# EAGLE design CacheMakerUno (EAGLE 6.5.0)
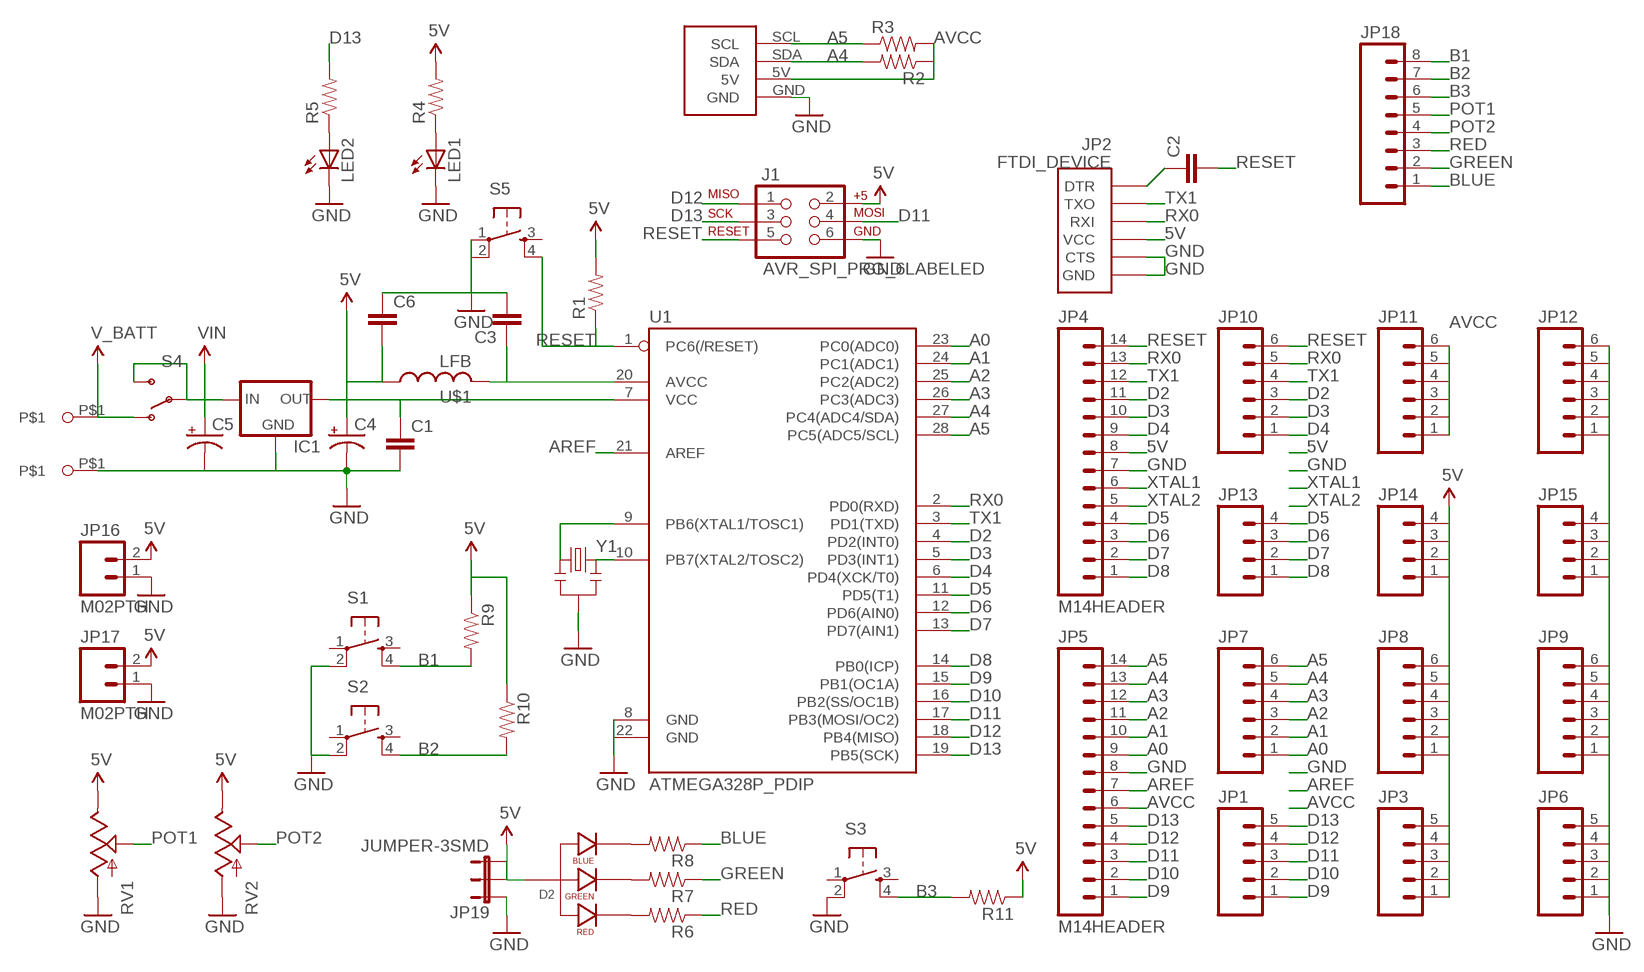
[diagram p0: schematic, sheet 1]

## Parts
C1  CAPPTH  [CAP-PTH-SMALL]
C2  CAPPTH  [CAP-PTH-SMALL]
C3  CAPPTH  [CAP-PTH-SMALL]
C4  CAP_POL2MM  [CAP-PTH-2MM]
C5  CAP_POL2MM  [CAP-PTH-2MM]
C6  CAPPTH  [CAP-PTH-SMALL]
D2  LED-RGB-CA-THRUDIFFUSE  [LED-RGB-THRU]
GND  M1  [M1_NO_STRAIN]
IC1  V_REG_78XXBASIC  [TO-220-REG-BASIC]
J1  AVR_SPI_PRG_6LABELED  [2X3-NS]
JP1  M05NO_SILK  [1X05_NO_SILK]
JP2  FTDI_DEVICE  [FTDI_DEVICE_SIDE]
JP3  M05NO_SILK  [1X05_NO_SILK]
JP4  M14HEADER  [1X14-HEADER]
JP5  M14HEADER  [1X14-HEADER]
JP6  M05NO_SILK  [1X05_NO_SILK]
JP7  M06SIP  [1X06]
JP8  M06SIP  [1X06]
JP9  M06SIP  [1X06]
JP10  M06SIP  [1X06]
JP11  M06SIP  [1X06]
JP12  M06SIP  [1X06]
JP13  M04PTH  [1X04]
JP14  M04PTH  [1X04]
JP15  M04PTH  [1X04]
JP16  M02PTH  [1X02]
JP17  M02PTH  [1X02]
JP18  M081X08  [1X08]
JP19  JUMPER-3SMD  [SJ_3]
LED1  LED5MM  [LED5MM]
LED2  LED5MM  [LED5MM]
R1  RESISTORAXIAL-0.3  [AXIAL-0.3]
R2  RESISTORAXIAL-0.3  [AXIAL-0.3]
R3  RESISTORAXIAL-0.3  [AXIAL-0.3]
R4  RESISTORPTH-1/4W-VERT  [AXIAL-0.1]
R5  RESISTORAXIAL-0.3  [AXIAL-0.3]
R6  RESISTORPTH-1/4W-VERT  [AXIAL-0.1]
R7  RESISTORPTH-1/4W-VERT  [AXIAL-0.1]
R8  RESISTORPTH-1/4W-VERT  [AXIAL-0.1]
R9  RESISTORPTH-1/4W-VERT  [AXIAL-0.1]
R10  RESISTORPTH-1/4W-VERT  [AXIAL-0.1]
R11  RESISTORPTH-1/4W-VERT  [AXIAL-0.1]
RV1  POTTRIM  [TRIM_POT]
RV2  POTTRIM  [TRIM_POT]
S1  TAC_SWITCHPTH  [TACTILE-PTH]
S2  TAC_SWITCHPTH  [TACTILE-PTH]
S3  TAC_SWITCHPTH  [TACTILE-PTH]
S4  SWITCH-SPDTPTH  [SWITCH-SPDT]
S5  TAC_SWITCHPTH  [TACTILE-PTH]
U1  ATMEGA328P_PDIP  [DIL28-3]
U$1  LFB  [ALFB-01]
U$2  I2C  [I2C]
V+  M1  [M1_NO_STRAIN]
Y1  RESONATORPTH  [RESONATOR-PTH]

## Nets
5V: C1.1 C4.+ C6.2 D2.2(ANODE) IC1.3(OUT) J1.2 JP2.P$4(VCC) JP3.1 JP3.2 JP3.3 JP3.4 JP3.5 JP4.8 JP8.1 JP8.2 JP8.3 JP8.4 JP8.5 JP8.6 JP14.1 JP14.2 JP14.3 JP14.4 JP16.2 JP17.2 JP19.2 JP19.3 R1.P$2 R4.P$2 R9.P$1 R10.P$1 R11.P$1 RV1.2(E) RV2.2(E) U1.7(VCC) U$1.1
A0: JP5.9 JP7.1 U1.23(PC0(ADC0))
A1: JP5.10 JP7.2 U1.24(PC1(ADC1))
A2: JP5.11 JP7.3 U1.25(PC2(ADC2))
A3: JP5.12 JP7.4 U1.26(PC3(ADC3))
A4: JP5.13 JP7.5 R2.P$2 U1.27(PC4(ADC4/SDA)) U$2.SDA
A5: JP5.14 JP7.6 R3.P$1 U1.28(PC5(ADC5/SCL)) U$2.SCL
AREF: JP5.7 U1.21(AREF)
AVCC: C3.1 JP5.6 JP11.1 JP11.2 JP11.3 JP11.4 JP11.5 JP11.6 R2.P$1 R3.P$2 U1.20(AVCC) U$1.2 U$2.5V
B1: JP18.8 R9.P$2 S1.4
B2: JP18.7 R10.P$2 S2.4
B3: JP18.6 R11.P$2 S3.4
BLUE: JP18.1 R8.P$1
D2: JP4.11 JP10.3 U1.4(PD2(INT0))
D3: JP4.10 JP10.2 U1.5(PD3(INT1))
D4: JP4.9 JP10.1 U1.6(PD4(XCK/T0))
D5: JP4.4 JP13.4 U1.11(PD5(T1))
D6: JP4.3 JP13.3 U1.12(PD6(AIN0))
D7: JP4.2 JP13.2 U1.13(PD7(AIN1))
D8: JP4.1 JP13.1 U1.14(PB0(ICP))
D9: JP1.1 JP5.1 U1.15(PB1(OC1A))
D10: JP1.2 JP5.2 U1.16(PB2(SS/OC1B))
D11: J1.4 JP1.3 JP5.3 U1.17(PB3(MOSI/OC2))
D12: J1.1 JP1.4 JP5.4 U1.18(PB4(MISO))
D13: J1.3 JP1.5 JP5.5 R5.P$2 U1.19(PB5(SCK))
DTR: C2.1 JP2.P$1(DTR)
GND: C1.2 C3.2 C4.- C5.- C6.1 GND.P$1 IC1.2(GND) J1.6 JP2.P$5(CTS) JP2.P$6(GND) JP4.7 JP5.8 JP6.1 JP6.2 JP6.3 JP6.4 JP6.5 JP9.1 JP9.2 JP9.3 JP9.4 JP9.5 JP9.6 JP12.1 JP12.2 JP12.3 JP12.4 JP12.5 JP12.6 JP15.1 JP15.2 JP15.3 JP15.4 JP16.1 JP17.1 JP19.1 LED1.K(C) LED2.K(C) RV1.3(A) RV2.3(A) S1.2 S2.2 S3.2 S5.1 S5.2 U1.8(GND) U1.22(GND) U$2.GND Y1.2
GREEN: JP18.2 R7.P$1
N$1: LED1.A R4.P$1
N$2: LED2.A R5.P$1
N$3: D2.1(RED_CATHODE) R6.P$2
N$4: D2.3(GREEN_CATHODE) R7.P$2
N$5: D2.4(BLUE_CATHODE) R8.P$2
POT1: JP18.5 RV1.1(S)
POT2: JP18.4 RV2.1(S)
RED: JP18.3 R6.P$1
RESET: C2.2 J1.5 JP4.14 JP10.6 R1.P$1 S5.4 U1.1(PC6(/RESET))
RX0: JP2.P$3(RXI) JP4.13 JP10.5 U1.2(PD0(RXD))
TX1: JP2.P$2(TXO) JP4.12 JP10.4 U1.3(PD1(TXD))
V_BATT: S4.1(O) V+.P$1
VIN: C5.+ IC1.1(IN) S4.2(P) S4.3(S)
XTAL1: JP4.6 U1.9(PB6(XTAL1/TOSC1)) Y1.1
XTAL2: JP4.5 U1.10(PB7(XTAL2/TOSC2)) Y1.3
Unconnected: S1.1 S1.3 S2.1 S2.3 S3.1 S3.3 S5.3

## Library data of the parts
C1-C3 C6 = barbary_enterprises:CAP: Capacitor Standard 0603 ceramic capacitor, and 0.1" leaded capacitor.
C4 C5 = barbary_enterprises:CAP_POL: Capacitor Polarized These are standard SMD and PTH capacitors. Normally 10uF, 47uF, and 100uF in electrolytic and tantalum varieties. Always verify the external diameter of the through hole cap, it varies with capacity, voltage, and manufacturer. The EIA devices should be standard.
D2 = barbary_enterprises:LED-RGB-CA-THRU: RGB Through-hole common anode SparkFun store front COM-10821 (diffuse) COM-10820 (clear); PROD_ID: DIO-10632
GND V+ = barbary_enterprises:M1
IC1 = SparkFun-PowerIC:V_REG_78XX: Voltage Regulator Standard 7805 5V regulator. IGO (Input Ground Output). Spark Fun Electronics SKU : COM-00107
J1 = barbary_enterprises:AVR_SPI_PRG_6: AVR ISP 6 Pin This is the reduced ISP connector for AVR programming. Common on Arduino. This footprint will take up less PCB space and can be used with a 10-pin to 6-pin adapter such as SKU: BOB-08508
JP1 JP3 JP6 = SparkFun-Connectors:M05: Header 5 Standard 5-pin 0.1" header. Use with straight break away headers (SKU : PRT-00116), right angle break away headers (PRT-00553), swiss pins (PRT-00743), machine pins (PRT-00117), and female headers (PRT-00115). Molex polarized connector foot print use with SKU : PRT-08230 with associated crimp pins and housings.
JP2 = SparkFun-Connectors:FTDI_DEVICE: Connector which mates to FTDI basic or FTDI cable.
JP4 JP5 = ProtoDuino:M14: Header 14 Standard 14-pin 0.1" header. Use with straight break away headers (SKU : PRT-00116), right angle break away headers (PRT-00553), swiss pins (PRT-00743), machine pins (PRT-00117), and female headers (PRT-00115).
JP7-JP12 = SparkFun-Connectors:M06: Header 6 Standard 6-pin 0.1" header. Use with straight break away headers (SKU : PRT-00116), right angle break away headers (PRT-00553), swiss pins (PRT-00743), machine pins (PRT-00117), and female headers (PRT-00115). Molex polarized connector foot print use with SKU : PRT-08094 with associated crimp pins and housings. NOTES ON THE VARIANTS LOCK and LOCK_LONGPADS... This footprint was designed to help hold the alignment of a through-hole component (i.e. 6-pin header) while soldering it into place. You may notice that each hole has been shifted either up or down by 0.005 of an inch from it's more standard position (which is a perfectly straight line). This slight alteration caused the pins (the squares in the middle) to touch the edges of the holes. Because they are alternating, it causes a "brace" to hold the component in place. 0.005 has proven to be the perfect amount of "off-center" position when using our standard breakaway headers. Although looks a little odd when you look at the bare footprint, once you have a header in there, the alteration is very hard to notice. Also,if you push a header all the way into place, it is covered up entirely on the bottom side. This idea of altering the position of holes to aid alignment will be further integrated into the Sparkfun Library for other footprints. It can help hold any component with 3 or more connection pins.
JP13-JP15 = SparkFun-Connectors:M04: Header 4 Standard 4-pin 0.1" header. Use with straight break away headers (SKU : PRT-00116), right angle break away headers (PRT-00553), swiss pins (PRT-00743), machine pins (PRT-00117), and female headers (PRT-00115). Molex polarized connector foot print use with SKU : PRT-08231 with associated crimp pins and housings. 1MM SMD Version SKU: PRT-10208
JP16 JP17 = SparkFun-Connectors:M02: Standard 2-pin 0.1" header. Use with - straight break away headers ( PRT-00116) - right angle break away headers (PRT-00553) - swiss pins (PRT-00743) - machine pins (PRT-00117) - female headers (PRT-00115) Molex polarized connector foot print use with: PRT-08233 with associated crimp pins and housings. 2.54_SCREWTERM for use with PRT-10571. 3.5mm Screw Terminal footprints for PRT-08084 5mm Screw Terminal footprints for use with PRT-08433
JP18 = SparkFun-Connectors:M08: Header 8 Standard 8-pin 0.1" header. Use with straight break away headers (SKU : PRT-00116), right angle break away headers (PRT-00553), swiss pins (PRT-00743), machine pins (PRT-00117), and female headers (PRT-00115).
JP19 = SparkFun-Passives:JUMPER-3
LED1 LED2 = SparkFun-LED:LED: LEDs Standard schematic elements and footprints for 5mm, 3mm, 1206, and 0603 sized LEDs. 5mm - Spark Fun Electronics SKU : COM-00529 (and others)
R1-R11 = SparkFun-Resistors:RESISTOR: Resistor Basic schematic elements and footprints for 0603, 1206, and PTH resistors.
RV1 RV2 = SparkFun-Electromechanical:POT
S1-S3 S5 = SparkFun-Electromechanical:TAC_SWITCH: Momentary Switch Button commonly used for reset or general input. Spark Fun Electronics SKU : COM-00097 SMT- SWCH-08247
S4 = SparkFun-Electromechanical:SWITCH-SPDT: SPDT Switch Simple slide switch, Spark Fun Electronics SKU : COM-00102 DPDT SMT slide switch, AYZ0202, SWCH-08179
U1 = SparkFun-DigitalIC:ATMEGA328P_PDIP: uC used in the Arduino 32kb flash, 1k EEPROM, 2k SRAM This is the through-hole version of this chip.
U$1 = barbary_enterprises:L
U$2 = barbary_enterprises:I2C
Y1 = SparkFun-FreqCtrl:RESONATOR: Resonator Small SMD resonator. Used, eg, on the Arduino Pro/ Pro Mini boards. 8MHz- XTAL-08895 16MHz- XTAL-08900

## Board
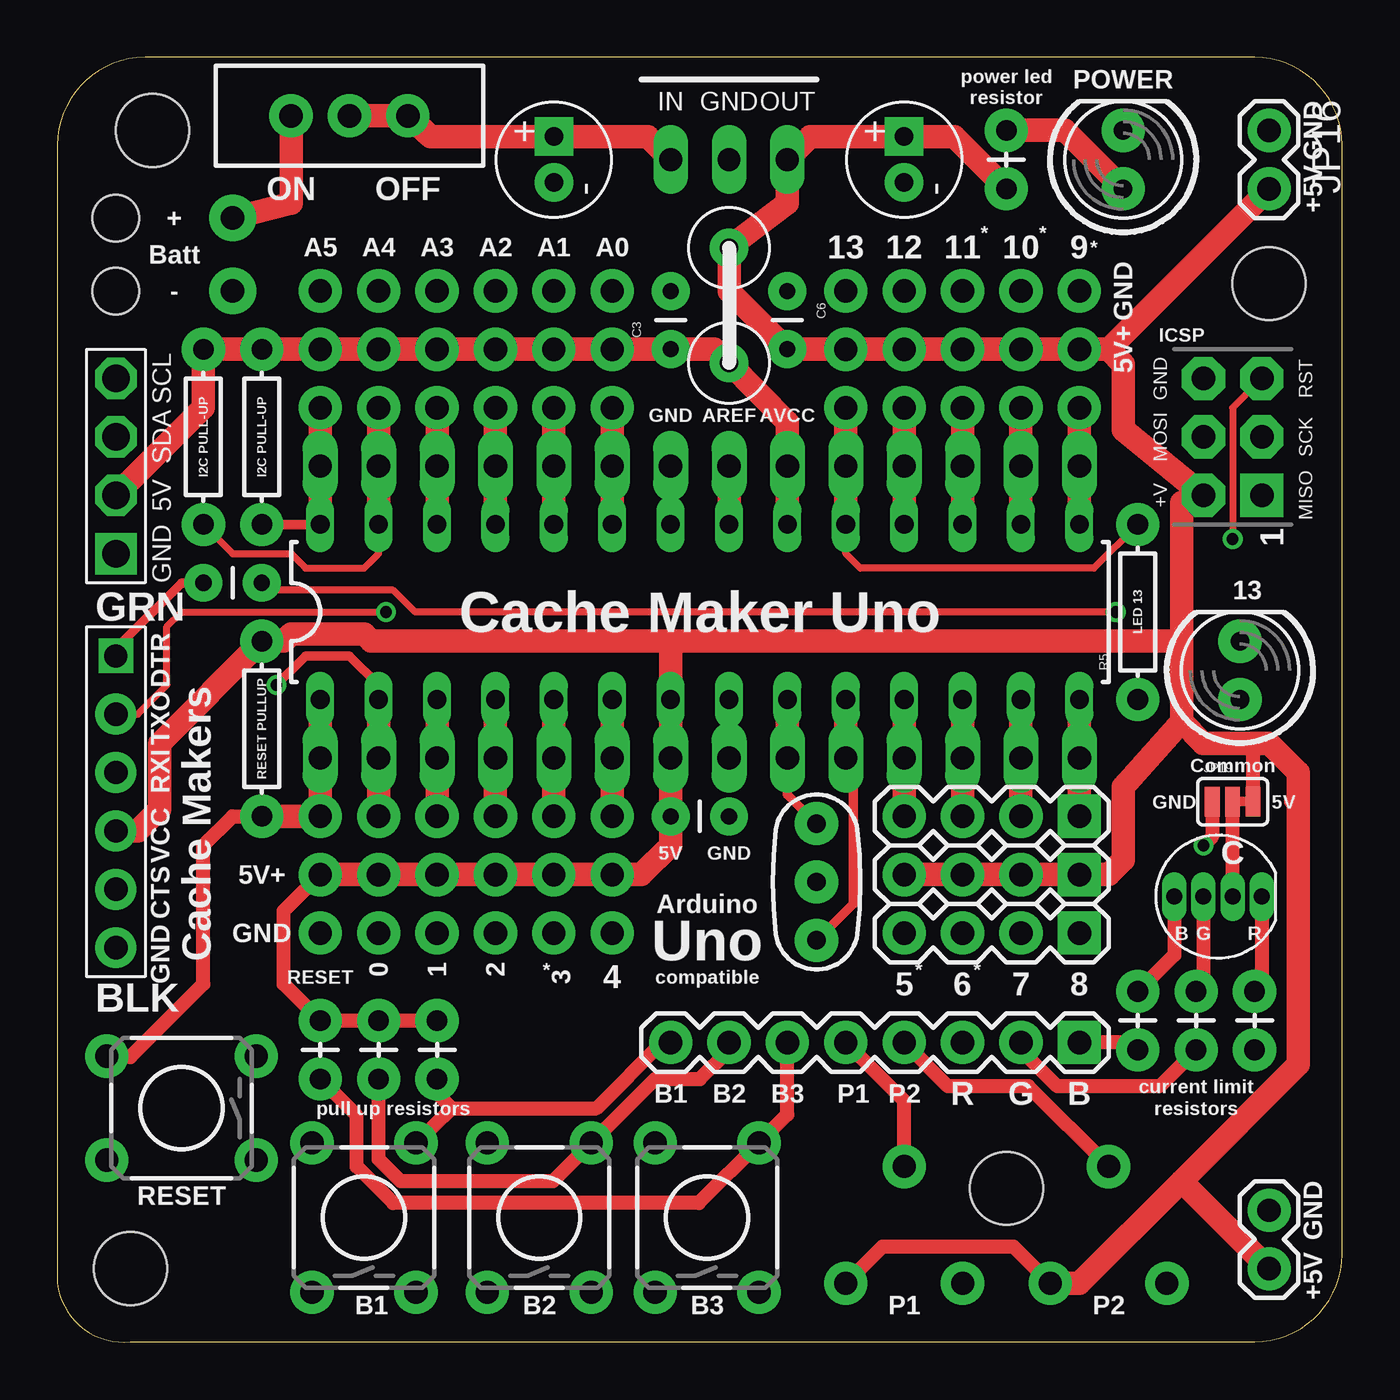
[diagram p1: board, top side]
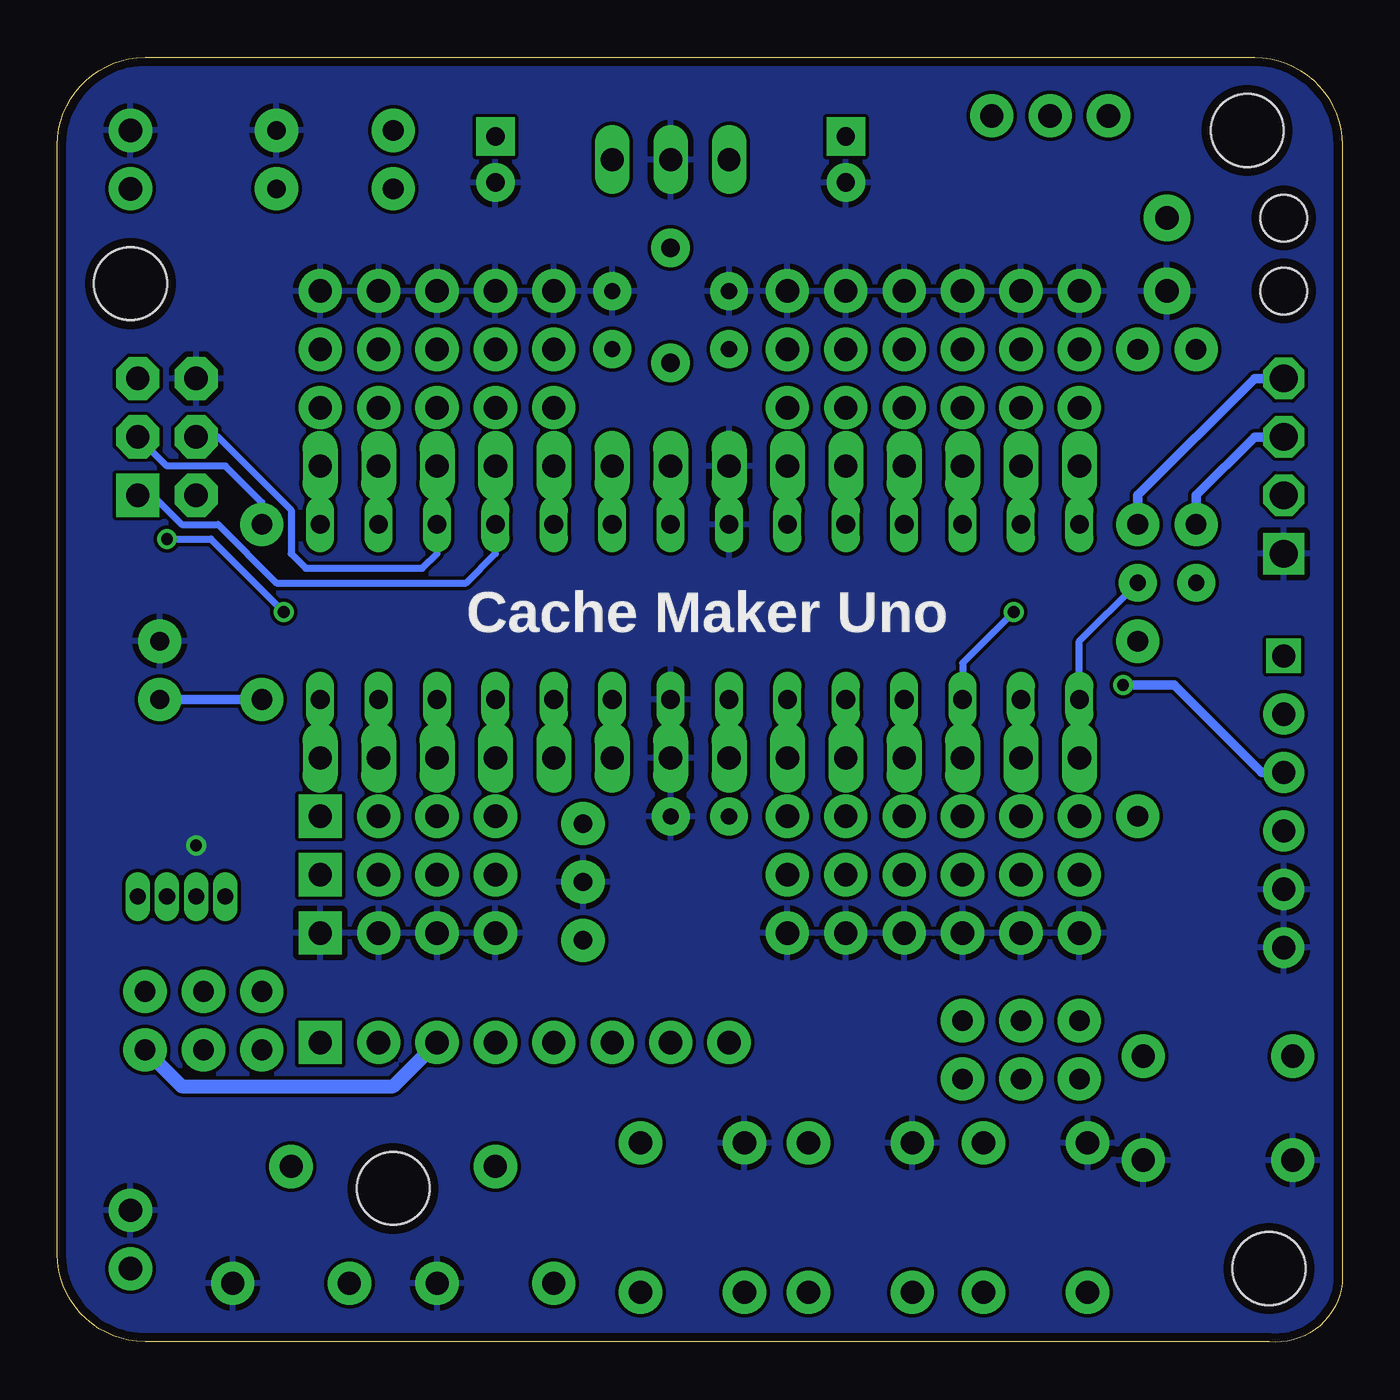
[diagram p2: board, bottom side, seen from below]

Size 55.88 x 55.9 mm. Coordinates in mm from the lower left corner, seen from the top.
Outline: 3.17,0.02 52.07,0.02 arc90 55.88,3.83 55.88,52.09 arc90 52.07,55.9 3.81,55.9 arc90 0,52.09 0,2.56 arc90 3.17,0.02
Copper layers (1*16): Top 0.0356mm / dielectric 1.5011mm / Bottom 0.0356mm
Design rules "LaenPCBOrder": minimum track width 6mil, minimum drill 13mil, track to track 6mil, track to pad 6mil, pad to pad 6mil, via to via 6mil, smd to smd 6mil, copper to edge 15mil, drill to drill 6mil, minimum pad ring 7mil, minimum via ring 7mil, stop-mask expansion 3mil, vias tented up to drill 0mil, thermal gap 10mil
Holes 3.17 mm at 3.17,3.19 4.13,52.72 52.7,46.05 41.27,6.68

### Footprints (pad centres in the part's own frame; a part is rotated, then mirrored left to right if it is on the bottom)
CAP-PTH-SMALL = drill 0.7 pad 1.651: 1 0,0; 2 2.54,0
CAP-PTH-2MM = drill 0.8 pad 1.676 square: + -1,0 | drill 0.8 pad 1.676: - 1,0
LED-RGB-THRU = drill 0.7 pad 0.813 long: 1 1.905,0; 2 0.635,0; 3 -0.635,0; 4 -1.905,0
M1_NO_STRAIN = drill 1.016 pad 2.032: P$1 0,0 | hole 2.032: 5.08,0
TO-220-REG-BASIC = drill 1 long: 1 -2.54,0; 2 0,0; 3 2.54,0
2X3-NS = drill 1.016 pad 1.88 square: 1 -2.54,-1.27 | drill 1.016 pad 1.88 octagon: 2 -2.54,1.27; 3 0,-1.27; 4 0,1.27; 5 2.54,-1.27; 6 2.54,1.27
1X05_NO_SILK = drill 1.016 pad 1.88: 1 0,0; 2 2.54,0; 3 5.08,0; 4 7.62,0; 5 10.16,0
FTDI_DEVICE_SIDE = drill 1 square: P$1 -6.35,0 | drill 1.016 pad 1.778: P$2 -3.81,0; P$3 -1.27,0; P$4 1.27,0; P$5 3.81,0; P$6 6.35,0
1X14-HEADER = drill 1.016 pad 1.27 long: 1 0,0; 2 2.54,0; 3 5.08,0; 4 7.62,0; 5 10.16,0; 6 12.7,0; 7 15.24,0; 8 17.78,0; 9 20.32,0; 10 22.86,0; 11 25.4,0; 12 27.94,0; 13 30.48,0; 14 33.02,0
1X06 = drill 1.016 pad 1.88: 1 0,0; 2 2.54,0; 3 5.08,0; 4 7.62,0; 5 10.16,0; 6 12.7,0
1X04 = drill 1.016 pad 1.88 square: 1 0,0 | drill 1.016 pad 1.88: 2 2.54,0; 3 5.08,0; 4 7.62,0
1X02 = drill 1.016 pad 1.88: 1 0,0; 2 2.54,0
1X08 = drill 1.016 pad 1.88 square: 1 0,0 | drill 1.016 pad 1.88: 2 2.54,0; 3 5.08,0; 4 7.62,0; 5 10.16,0; 6 12.7,0; 7 15.24,0; 8 17.78,0
SJ_3 = smd 0.635 x 1.27: 1 -0.889,0; 2 0,0; 3 0.889,0
LED5MM = drill 0.813 pad 1.88: A -1.27,0; K 1.27,0
AXIAL-0.3 = drill 0.9 pad 1.88: P$1 -3.81,0; P$2 3.81,0
AXIAL-0.1 = drill 0.9 pad 1.88: P$1 0,0; P$2 2.54,0
TRIM_POT = drill 1 pad 1.88: 1 5.08,0; 2 0,2.54; 3 0,-2.54
TACTILE-PTH = drill 1.016 pad 1.88: 1 -3.251,2.261; 2 3.251,2.261; 3 -3.251,-2.261; 4 3.251,-2.261
SWITCH-SPDT = drill 1.016 pad 1.88: 1 0,2.54; 2 0,0; 3 0,-2.54
DIL28-3 = drill 0.813 long: 1 -16.51,-3.81; 2 -13.97,-3.81; 3 -11.43,-3.81; 4 -8.89,-3.81; 5 -6.35,-3.81; 6 -3.81,-3.81; 7 -1.27,-3.81; 8 1.27,-3.81; 9 3.81,-3.81; 10 6.35,-3.81; 11 8.89,-3.81; 12 11.43,-3.81; 13 13.97,-3.81; 14 16.51,-3.81; 15 16.51,3.81; 16 13.97,3.81; 17 11.43,3.81; 18 8.89,3.81; 19 6.35,3.81; 20 3.81,3.81; 21 1.27,3.81; 22 -1.27,3.81; 23 -3.81,3.81; 24 -6.35,3.81; 25 -8.89,3.81; 26 -11.43,3.81; 27 -13.97,3.81; 28 -16.51,3.81
ALFB-01 = drill 0.8 pad 1.676: 1 -2.5,0; 2 2.5,0
I2C = drill 1.2 octagon: 5V 0,2.54; SCL 0,7.62; SDA 0,5.08 | drill 1.2 square: GND 0,0
RESONATOR-PTH = drill 0.8 pad 1.88: 1 -2.54,0; 2 0,0; 3 2.54,0

### Placement (x,y rotation side)
C1  26.67,22.88 0 top
C2  6.35,33.04 0 top
C3  26.67,43.2 90 top
C4  36.83,51.45 270 top
C5  21.59,51.45 270 top
C6  31.75,45.74 270 top
D2  50.48,19.38 0 top
GND  7.62,45.74 180 top
IC1  29.21,51.45 0 top
J1  51.12,39.39 90 top
JP1  44.45,40.66 180 top
JP2  2.54,23.51 270 top
JP3  44.45,43.2 180 top
JP4  44.45,25.42 180 top
JP5  44.45,38.12 180 top
JP6  44.45,45.74 180 top
JP7  24.13,40.66 180 top
JP8  24.13,20.34 180 top
JP9  24.13,45.74 180 top
JP10  24.13,22.88 180 top
JP11  24.13,43.2 180 top
JP12  24.13,17.8 180 top
JP13  44.45,22.88 180 top
JP14  44.45,20.34 180 top
JP15  44.45,17.8 180 top
JP16  52.7,52.72 270 top
JP17  52.7,5.73 270 top
JP18  44.45,13.03 180 top
JP19  51.12,23.51 0 top
LED1  46.35,51.45 90 top
LED2  51.44,29.23 90 top
R1  8.89,26.69 90 top
R2  6.35,39.39 270 top
R3  8.89,39.39 90 top
R4  41.27,52.72 270 top
R5  46.99,31.77 90 top
R6  52.07,12.72 90 top
R7  49.53,12.72 90 top
R8  46.99,12.72 90 top
R9  16.51,13.99 270 top
R10  13.97,13.99 270 top
R11  11.43,13.99 270 top
RV1  36.83,2.56 90 top
RV2  45.72,2.56 90 top
S1  13.34,5.41 90 top
S2  20.95,5.41 90 top
S3  28.26,5.41 90 top
S4  12.7,53.36 90 top
S5  5.4,10.18 180 top
U1  27.94,31.77 0 top
U$1  29.21,45.1 270 top
U$2  2.54,34.31 0 top
V+  7.62,48.91 180 top
Y1  33.02,20.02 270 top

### Tracks (layer width: path | path; a pad name or v marks a point on that pad's centre or on a via)
5V
  Top 0.406: JP19.2 JP19.3
  Top 0.61: RV2.2 41.59,4.15 35.88,4.15 RV1.2 | R9.P$1 R10.P$1 R11.P$1 9.84,15.57 9.84,18.75 JP8.6 | D2.2 JP19.2 | 53.66,23.51 53.98,23.83 | JP19.3 52.01,25.8 51.75,26.05
  Top 1.016: JP8.6 JP8.5 JP8.4 JP8.3 JP8.2 JP8.1 25.4,20.34 26.67,21.61 C1.1 JP4.8 U1.7 26.67,30.5 | JP14.4 JP14.3 JP14.2 JP14.1 45.72,20.34 46.35,20.97 46.35,24.15 48.9,27.01 | 26.67,30.5 13.65,30.5 13.34,30.81 10.16,30.81 9.84,30.5 R1.P$2 4.45,26.05 4.45,23.19 3.49,22.24 JP2.P$4 | 48.9,30.5 26.67,30.5 | 45.72,43.2 46.35,42.56 46.35,39.71 J1.2 48.9,36.53 48.9,30.5 | 45.72,43.2 JP3.1 JP3.2 JP3.3 JP3.4 JP3.5 C6.2 29.21,45.74 U$1.1 29.21,47.64 31.75,49.55 IC1.3 32.75,52.45 C4.+ 39.01,52.45 R4.P$2 | 48.9,27.01 48.9,30.5 | JP16.2 45.72,43.2 | JP17.2 48.9,7 | 48.9,7 53.98,12.08 53.98,23.83 53.98,24.78 52.7,26.05 51.75,26.05 49.85,26.05 48.9,27.01 | 48.9,7 44.45,2.56 RV2.2
A0
  Top 1.016: U1.23 JP5.9 JP7.1
A1
  Top 1.016: U1.24 JP5.10 JP7.2
A2
  Top 1.016: U1.25 JP5.11 JP7.3
A3
  Top 1.016: JP7.4 JP5.12 U1.26
A4
  Top 0.305: R2.P$2 7.62,34.31 10.16,34.31 10.79,33.67 13.34,33.67 13.97,34.31 U1.27
  Top 1.016: U1.27 JP5.13 JP7.5
  Bottom 0.406: U$2.SDA 3.81,39.39 6.35,36.85 R2.P$2
A5
  Top 0.406: R3.P$1 U1.28
  Top 1.016: JP7.6 JP5.14 U1.28
  Bottom 0.406: U$2.SCL 3.81,41.93 8.89,36.85 R3.P$1
AREF
  Top 1.016: U1.21 JP5.7
AVCC
  Top 1.016: U1.20 JP5.6 31.75,40.02 U$1.2 28.57,43.2 C3.1 JP11.1 JP11.2 JP11.3 JP11.4 JP11.5 JP11.6 R3.P$2 R2.P$1 6.35,40.66 U$2.5V
B1
  Top 0.61: S1.4 17.14,10.18 | 17.14,10.18 23.46,10.18 26.31,13.04 JP18.8 | 17.14,10.18 16.51,10.81 R9.P$2
B2
  Top 0.61: JP18.7 29.21,12.72 27.94,11.45 26,11.45 S2.4 21.55,7 14.92,7 13.97,7.96 R10.P$2
B3
  Top 0.61: JP18.6 31.75,9.9 S3.4 27.9,6.05 14.61,6.05 13.02,7.64 13.02,9.86 R11.P$2
BLUE
  Top 0.61: R8.P$1 46.67,13.04 JP18.1
D2
  Top 1.016: JP10.3 JP4.11 U1.4
D3
  Top 1.016: U1.5 JP4.10 JP10.2
D4
  Top 1.016: U1.6 JP4.9 JP10.1
D5
  Top 1.016: U1.11 JP4.4 JP13.4
D6
  Top 1.016: U1.12 JP4.3 JP13.3
D7
  Top 1.016: U1.13 JP4.2 JP13.2
D8
  Top 1.016: JP13.1 JP4.1 U1.14
D9
  Top 1.016: U1.15 JP5.1 JP1.1
D10
  Top 1.016: U1.16 JP5.2 JP1.2
D11
  Top 1.016: U1.17 JP5.3 JP1.3
  Bottom 0.305: J1.4 48.9,39.39 45.72,36.21 45.72,34.31 45.09,33.67 40.01,33.67 39.37,34.31 U1.17
D12
  Top 1.016: U1.18 JP5.4 JP1.4
  Bottom 0.305: J1.1 51.75,36.85 50.48,35.58 48.9,35.58 46.35,33.04 38.1,33.04 36.83,34.31 U1.18
D13
  Top 0.305: U1.19 34.29,34.31 34.92,33.67 45.09,33.67 R5.P$2
  Top 1.016: U1.19 JP5.5 JP1.5
  Bottom 0.305: J1.3 51.12,38.12 48.58,38.12 46.99,36.53 R5.P$2
DTR
  Top 0.406: JP2.P$1 2.54,30.18 5.4,33.04 C2.1
GND  (via drill 0.51)
  Top 0.61: JP19.1 50.23,21.99 v49.85,21.61
  pour Bottom: 0,0.02 52.07,0.02 arc90 55.88,3.83 55.88,52.09 arc90 52.07,55.9 3.81,55.9 arc90 0,52.09
GREEN
  Top 0.61: R7.P$1 47.94,11.13 43.5,11.13 41.91,12.72 JP18.2
N$1
  Top 1.016: R4.P$1 43.81,52.72 LED1.A
N$2
  Bottom 0.406: R5.P$1 LED2.A
N$3
  Top 0.61: D2.1 52.39,15.57 R6.P$2
N$4
  Top 0.61: D2.3 49.85,15.57 R7.P$2
N$5
  Top 0.61: D2.4 48.58,16.85 R8.P$2
POT1
  Top 0.61: RV1.1 36.83,10.49 JP18.5
POT2
  Top 0.61: RV2.1 42.23,11.13 38.73,11.13 JP18.4
RED
  Bottom 0.61: R6.P$1 50.48,11.13 41.27,11.13 JP18.3
RESET  (via drill 0.51)
  Top 0.305: v46.04,31.77 15.56,31.77 14.61,32.72 9.21,32.72 C2.2 | J1.5 51.12,40.66 v51.12,34.94
  Top 0.61: S5.4 3.17,12.4 6.35,15.57 6.35,21.61 7.62,22.88 JP10.6
  Top 1.016: U1.1 JP4.14 JP10.6 R1.P$1
  Bottom 0.305: v46.04,31.77 49.21,34.94 v51.12,34.94 | U1.1 11.43,30.5 C2.2
RX0  (via drill 0.51)
  Top 0.406: v9.53,28.59 10.79,29.86 12.7,29.86 13.97,28.59 U1.2
  Top 1.016: JP10.5 JP4.13 U1.2
  Bottom 0.406: JP2.P$3 3.49,24.78 7.3,28.59 v9.53,28.59
TX1  (via drill 0.51)
  Top 0.305: JP2.P$2 3.49,27.32 4.76,28.59 4.76,31.13 5.4,31.77 v14.29,31.77
  Top 1.016: U1.3 JP4.12 JP10.4
  Bottom 0.305: v14.29,31.77 16.51,29.54 U1.3
V_BATT
  Top 1.016: S4.1 10.16,49.55 V+.P$1
VIN
  Top 1.016: IC1.1 25.67,52.45 C5.+ 16.24,52.45 S4.3 S4.2
XTAL1
  Top 0.406: Y1.1 31.75,23.83 JP4.6
  Top 1.016: JP4.6 U1.9
XTAL2
  Top 0.406: Y1.3 34.61,19.07 34.61,25.1 JP4.5
  Top 1.016: JP4.5 U1.10

### Text on the board
tPlace: power led / resistor | POWER | GND | ON | OFF | +5V | + | A5 | A4 | A3 | A2 | A1 | A0 | 13 | 12 | 11 | * | 10 | * | 9 | * | Batt | - | GND | ICSP | 5V+ | GND | AREF | AVCC | I2C PULL-UP | I2C PULL-UP | 1 | 13 | Cache Maker Uno | LED 13 | RESET PULLUP | Common | Cache Makers | GND | 5V | 5V | GND | C | 5V+ | Arduino | GND | B | G | R | Uno | RESET | 0 | 1 | 2 | * | 3 | 4 | compatible | 5 | * | 6 | * | 7 | 8 | B1 | B2 | B3 | P1 | P2 | R | G | B | current limit | pull up resistors | resistors | RESET | GND | +5V | B1 | B2 | B3 | P1 | P2
bPlace: Cache Maker Uno